# EAGLE design RHD2164_headstage1 (EAGLE 6.2)
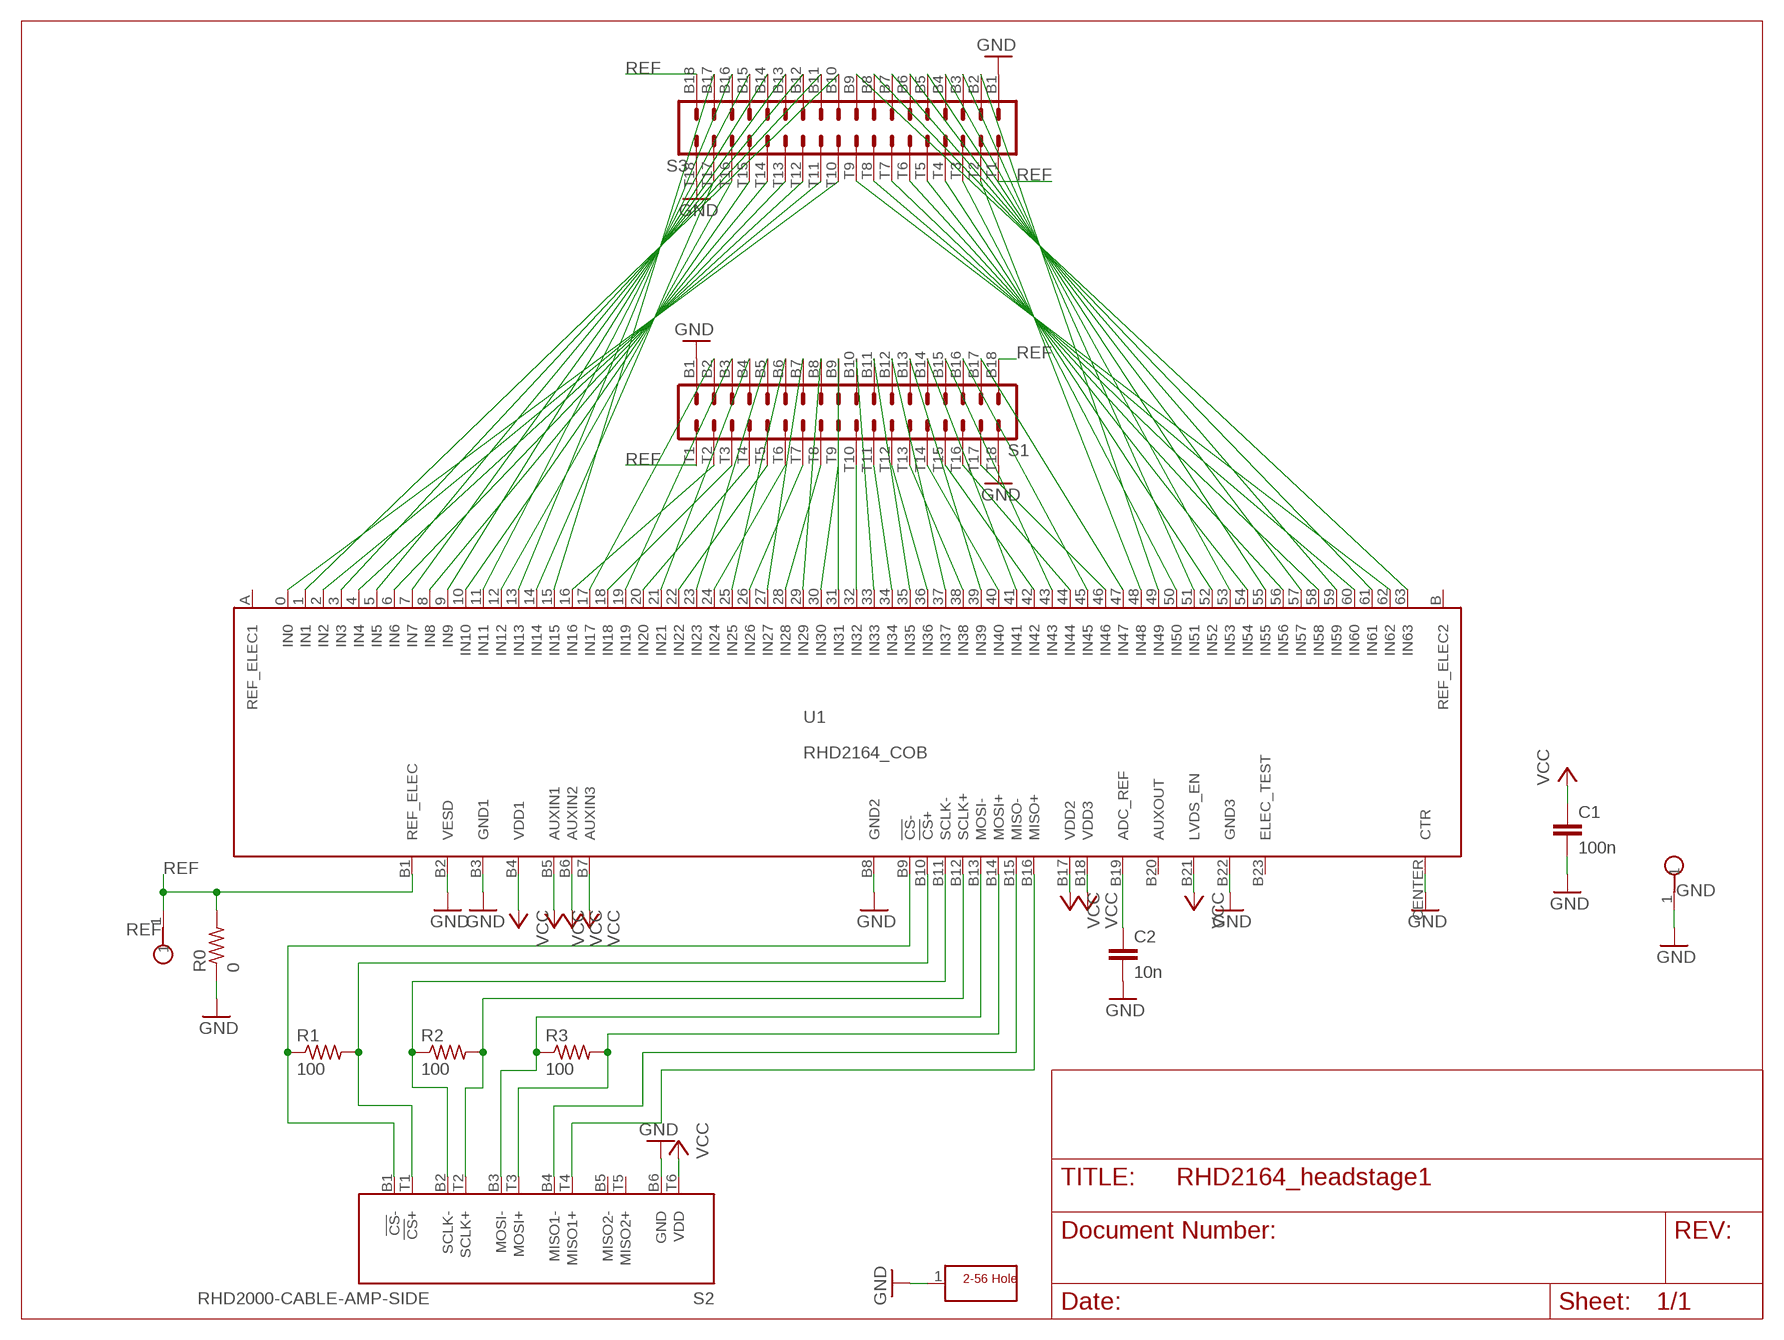
[diagram p0: schematic, sheet 1]

## Parts
C1  100n  C_0402  [0402]
C2  10n  C_0201  [0201]
GND  TESTPOINT_SMALL  [TESTPOINT_SMALL]
H1  SCREW_HOLE_2-56  [SCREW_HOLE_2-56]
R0  0  R_0402  [0402]
R1  100  R_0201  [0201]
R2  100  R_0201  [0201]
R3  100  R_0201  [0201]
REF  TESTPOINT_SMALL  [TESTPOINT_SMALL]
S1  OMNETICS_A79025  [OMNETICS_A79025]
S2  RHD2000-CABLE-AMP-SIDE  [OMNETICS_PZN-12-AA]
S3  OMNETICS_A79025  [OMNETICS_A79025]
U1  RHD2164_COB  [RHD2164_COB]

## Nets
GND [thick]: C1.2 C2.2 GND.1 H1.1 R0.1 S1.B1 S1.T18 S2.B6(GND) S3.B1 S3.T18 U1.B2(VESD) U1.B3(GND1) U1.B8(GND2) U1.B22(GND3) U1.CENTER(CTR)
N$1: S2.T4(MISO1+) U1.B16(MISO+)
N$2: S1.T2 U1.16(IN16)
N$3: S1.B2 U1.17(IN17)
N$4: S1.T3 U1.18(IN18)
N$5: S1.B3 U1.19(IN19)
N$6: S1.T4 U1.20(IN20)
N$7: S1.B4 U1.21(IN21)
N$8: S1.T5 U1.22(IN22)
N$9: S1.B5 U1.23(IN23)
N$10: S1.T6 U1.24(IN24)
N$11: R1.1 S2.B1(!CS!-) U1.B9(!CS!-)
N$12: S1.B6 U1.25(IN25)
N$13: S1.T7 U1.26(IN26)
N$14: S1.B7 U1.27(IN27)
N$15: S1.T8 U1.28(IN28)
N$16: S1.B8 U1.29(IN29)
N$17: S1.T9 U1.30(IN30)
N$18: S1.B9 U1.31(IN31)
N$19: S1.T10 U1.32(IN32)
N$20: S1.B10 U1.33(IN33)
N$21: S1.T11 U1.34(IN34)
N$22: S1.B11 U1.35(IN35)
N$23: S1.T12 U1.36(IN36)
N$24: S1.B12 U1.37(IN37)
N$25: S1.T13 U1.38(IN38)
N$26: S1.B13 U1.39(IN39)
N$27: S1.T14 U1.40(IN40)
N$28: S1.B14 U1.41(IN41)
N$29: S1.T15 U1.42(IN42)
N$30: S1.B15 U1.43(IN43)
N$31: S1.T16 U1.44(IN44)
N$32: S1.B16 U1.45(IN45)
N$33: S1.T17 U1.46(IN46)
N$34: S1.B17 U1.47(IN47)
N$35: R1.2 S2.T1(!CS!+) U1.B10(!CS!+)
N$36: R2.1 S2.B2(SCLK-) U1.B11(SCLK-)
N$37: R2.2 S2.T2(SCLK+) U1.B12(SCLK+)
N$38: R3.1 S2.B3(MOSI-) U1.B13(MOSI-)
N$39: R3.2 S2.T3(MOSI+) U1.B14(MOSI+)
N$40: S2.B4(MISO1-) U1.B15(MISO-)
N$41: S3.B17 U1.15(IN15)
N$42 [thick]: C2.1 U1.B19(ADC_REF)
N$43: S3.T17 U1.14(IN14)
N$44: S3.B16 U1.13(IN13)
N$45: S3.T16 U1.12(IN12)
N$46: S3.B15 U1.11(IN11)
N$47: S3.T15 U1.10(IN10)
N$48: S3.B14 U1.9(IN9)
N$49: S3.T14 U1.8(IN8)
N$50: S3.B13 U1.7(IN7)
N$51: S3.T13 U1.6(IN6)
N$52: S3.B12 U1.5(IN5)
N$53: S3.T12 U1.4(IN4)
N$54: S3.B11 U1.3(IN3)
N$55: S3.T11 U1.2(IN2)
N$56: S3.B10 U1.1(IN1)
N$57: S3.T10 U1.0(IN0)
N$58: S3.T2 U1.48(IN48)
N$59: S3.B2 U1.49(IN49)
N$60: S3.T3 U1.50(IN50)
N$61: S3.B3 U1.51(IN51)
N$62: S3.T4 U1.52(IN52)
N$63: S3.B4 U1.53(IN53)
N$64: S3.T5 U1.54(IN54)
N$65: S3.B5 U1.55(IN55)
N$66: S3.T6 U1.56(IN56)
N$67: S3.B6 U1.57(IN57)
N$68: S3.T7 U1.58(IN58)
N$69: S3.B7 U1.59(IN59)
N$70: S3.T8 U1.60(IN60)
N$71: S3.B8 U1.61(IN61)
N$72: S3.T9 U1.62(IN62)
N$73: S3.B9 U1.63(IN63)
REF [thick]: R0.2 REF.1 S1.B18 S1.T1 S3.B18 S3.T1 U1.B1(REF_ELEC)
VCC [thick]: C1.1 S2.T6(VDD) U1.B4(VDD1) U1.B5(AUXIN1) U1.B6(AUXIN2) U1.B7(AUXIN3) U1.B17(VDD2) U1.B18(VDD3) U1.B21(LVDS_EN)
Unconnected: S2.B5(MISO2-) S2.T5(MISO2+) U1.A(REF_ELEC1) U1.B20(AUXOUT) U1.B23(ELEC_TEST) U1.B(REF_ELEC2)

## Library data of the parts
C1 C2 = RHD2000_eval_board:C: Capacitor
GND REF = RHD2000_eval_board:TESTPOINT: PCB Test Point
H1 = RHD2000_eval_board:SCREW_HOLE_2-56: Mounting hole
R0 R1-R3 = RHD2000_eval_board:R: Resistor
S1 S3 = RHD2000:OMNETICS_A79025
S2 = RHD2000:RHD2000-CABLE-AMP-SIDE
U1 = RHD2000:RHD2164

## Net classes
1 thick: width 0.102 mm
2 power: width 0.61 mm

## Board
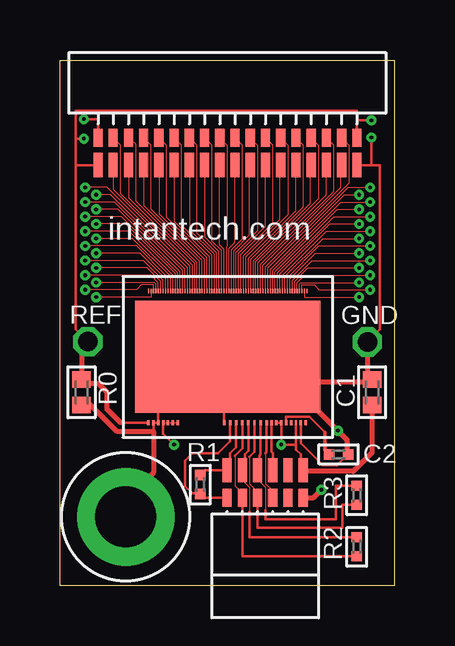
[diagram p1: board, top side]
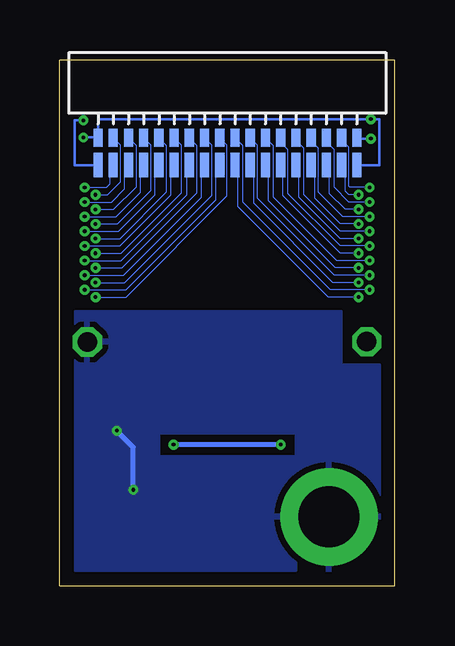
[diagram p2: board, bottom side, seen from below]

Size 13.97 x 21.91 mm. Coordinates in mm from the lower left corner, seen from the top.
Outline: 0,0 0,21.91 13.97,21.91 13.97,0 0,0
Copper layers (1*16): Top 0.035mm / dielectric 1.5mm / Bottom 0.035mm
Design rules: minimum track width 2mil, minimum drill 6mil, track to track 2mil, track to pad 2mil, pad to pad 2mil, via to via 2mil, smd to smd 2mil, copper to edge 20mil, drill to drill 15mil, minimum pad ring 5mil, minimum via ring 5mil, stop-mask expansion 2mil, vias tented up to drill 0mil, thermal gap 10mil
tRestrict: area 6.9,6.6 to 7,6.9; area 7.2,6.6 to 7.3,6.9; area 7.5,6.6 to 7.5,6.9; area 7.7,6.6 to 7.8,6.9; area 8,6.6 to 8,6.9; area 8.2,6.6 to 8.3,6.9

### Footprints (pad centres in the part's own frame; a part is rotated, then mirrored left to right if it is on the bottom)
0402 = smd 0.686 x 0.762: 1 -0.533,0; 2 0.533,0
0201 = smd 0.432 x 0.432: 1 -0.394,0; 2 0.394,0
TESTPOINT_SMALL = drill 0.813 octagon: 1 0,0
SCREW_HOLE_2-56 = drill 2.54 pad 4.064: 1 0,0
OMNETICS_A79025 = smd 0.381 x 0.762: B1 -5.397,-1.016; B2 -4.763,-1.016; B3 -4.128,-1.016; B4 -3.493,-1.016; B5 -2.857,-1.016; B6 -2.223,-1.016; B7 -1.587,-1.016; B8 -0.953,-1.016; B9 -0.318,-1.016; B10 0.318,-1.016; B11 0.953,-1.016; B12 1.587,-1.016; B13 2.223,-1.016; B14 2.857,-1.016; B15 3.493,-1.016; B16 4.128,-1.016; B17 4.763,-1.016; B18 5.397,-1.016 | smd 0.381 x 1.016: T1 -5.397,-2.159; T2 -4.763,-2.159; T3 -4.128,-2.159; T4 -3.493,-2.159; T5 -2.857,-2.159; T6 -2.223,-2.159; T7 -1.587,-2.159; T8 -0.953,-2.159; T9 -0.318,-2.159; T10 0.318,-2.159; T11 0.953,-2.159; T12 1.587,-2.159; T13 2.223,-2.159; T14 2.857,-2.159; T15 3.493,-2.159; T16 4.128,-2.159; T17 4.763,-2.159; T18 5.397,-2.159
OMNETICS_PZN-12-AA = smd 0.381 x 0.762: B1 1.587,-1.016; B2 0.953,-1.016; B3 0.318,-1.016; B4 -0.318,-1.016; B5 -0.953,-1.016; B6 -1.587,-1.016 | smd 0.381 x 1.016: T1 1.587,-2.159; T2 0.953,-2.159; T3 0.318,-2.159; T4 -0.318,-2.159; T5 -0.953,-2.159; T6 -1.587,-2.159
RHD2164_COB = smd 0.051 x 0.203: 0 -3.2,2.743; 1 -3.099,2.743; 2 -2.997,2.743; 3 -2.896,2.743; 4 -2.794,2.743; 5 -2.692,2.743; 6 -2.591,2.743; 7 -2.489,2.743; 8 -2.388,2.743; 9 -2.286,2.743; 10 -2.184,2.743; 11 -2.083,2.743; 12 -1.981,2.743; 13 -1.88,2.743; 14 -1.778,2.743; 15 -1.676,2.743; 16 -1.575,2.743; 17 -1.473,2.743; 18 -1.372,2.743; 19 -1.27,2.743; 20 -1.168,2.743; 21 -1.067,2.743; 22 -0.965,2.743; 23 -0.864,2.743; 24 -0.762,2.743; 25 -0.66,2.743; 26 -0.559,2.743; 27 -0.457,2.743; 28 -0.356,2.743; 29 -0.254,2.743; 30 -0.152,2.743; 31 -0.051,2.743; 32 0.051,2.743; 33 0.152,2.743; 34 0.254,2.743; 35 0.356,2.743; 36 0.457,2.743; 37 0.559,2.743; 38 0.66,2.743; 39 0.762,2.743; 40 0.864,2.743; 41 0.965,2.743; 42 1.067,2.743; 43 1.168,2.743; 44 1.27,2.743; 45 1.372,2.743; 46 1.473,2.743; 47 1.575,2.743; 48 1.676,2.743; 49 1.778,2.743; 50 1.88,2.743; 51 1.981,2.743; 52 2.083,2.743; 53 2.184,2.743; 54 2.286,2.743; 55 2.388,2.743; 56 2.489,2.743; 57 2.591,2.743; 58 2.692,2.743; 59 2.794,2.743; 60 2.896,2.743; 61 2.997,2.743; 62 3.099,2.743; 63 3.2,2.743; A -3.302,2.743; B 3.302,2.743 | smd 0.102 x 0.203: B1 -3.302,-2.743; B2 -3.099,-2.743; B3 -2.896,-2.743; B4 -2.692,-2.743; B5 -2.489,-2.743; B6 -2.286,-2.743; B7 -2.083,-2.743; B8 -0.152,-2.743; B9 0.102,-2.743; B10 0.356,-2.743; B11 0.61,-2.743; B12 0.864,-2.743; B13 1.118,-2.743; B14 1.372,-2.743; B15 1.626,-2.743; B16 1.829,-2.743; B17 2.032,-2.743; B18 2.235,-2.743; B19 2.438,-2.743; B20 2.642,-2.743; B21 2.845,-2.743; B22 3.048,-2.743; B23 3.251,-2.743 | smd 7.722 x 4.674: CENTER 0,0

### Placement (x,y rotation side)
C1  13.02,8.06 90 top
C2  11.62,5.47 0 top
GND  12.83,10.16 0 top
H1  2.74,2.87 0 top
R0  0.9,8.06 90 top
R1  5.85,4.22 90 top
R2  12.38,1.63 90 top
R3  12.38,3.77 90 top
REF  1.17,10.17 0 top
S1  6.99,19.68 0 top
S2  8.56,2.65 180 top
S3  6.99,19.68 0 bottom
U1  7,9.54 0 top

### Tracks (layer width: path | path; a pad name or v marks a point on that pad's centre or on a via)
GND  (via drill 0.15)
  Top 0.102: S1.T18 12.99,17.53 | v1,19.44 1.59,19.44 S1.B1 | 12.99,17.53 v12.99,18.68 | 12.99,17.53 13.35,17.53 13.35,10.68 GND.1 | 7,7.53 7,7.66 | 7,7.66 U1.CENTER | U1.B8 6.84,7.56 6.87,7.53 | 12.83,8.79 C1.2 13.02,8.47 | 3.9,6.44 U1.B2 U1.B3 4.1,7.28 4.13,7.3 6.64,7.3 6.87,7.53 | U1.B22 10.05,5.93 10.96,5.02 11.56,5.02 C2.2 11.98,5.51 | 9.59,8.47 9.34,8.47 8.52,7.66 7,7.66 | 6.87,7.53 7,7.66 | 2.74,3.56 2.73,3.54
  Top 0.203: GND.1 12.83,8.79 | 13.02,8.47 9.59,8.47 v11.6,6.46 11.98,6.08 11.98,5.51 | R0.1 1.28,7.53 2.38,6.44 3.9,6.44 3.9,4.71 2.74,3.56 H1.1 | S2.B6 10.58,3.67 v10.91,4
  Bottom 0.051: v12.99,18.68 12.39,18.68 S3.B1 | S3.T18 1.56,17.53 1.56,17.51
  Bottom 0.102: S3.T18 0.65,17.53 0.65,19.44 v1,19.44 12.38,19.44 12.38,18.68 v12.99,18.68
  Bottom 0.203: v10.91,4 10.91,5.78 v11.6,6.46
  pour Bottom: 0.64,0.64 0.64,9.21 2.22,9.21 2.22,11.43 13.34,11.43 13.34,0.64 9.84,0.64 9.84,6.35 4.13,6.35 4.13,0.64
  pour Bottom: 4.13,0.64 4.13,5.4 9.84,5.4 9.84,0.64
N$1
  Top 0.102: U1.B16 8.83,5.58 8.88,5.52 S2.T4
N$2
  Top 0.051: U1.16 5.42,13.31 2.23,16.5 2.23,17.51 S1.T2
N$3
  Top 0.051: U1.17 5.52,13.36 2.54,16.34 2.54,18.35 S1.B2
N$4
  Top 0.051: U1.18 5.63,13.41 2.9,16.14 2.9,17.49 S1.T3
N$5
  Top 0.051: U1.19 5.73,13.46 3.17,16.02 3.17,18.4 S1.B3
N$6
  Top 0.051: U1.20 5.83,13.51 3.5,15.84 3.5,17.51 S1.T4
N$7
  Top 0.051: U1.21 5.93,13.56 3.81,15.68 3.81,18.35 S1.B4
N$8
  Top 0.051: U1.22 6.03,13.61 4.17,15.48 4.17,17.49 S1.T5
N$9
  Top 0.051: U1.23 6.13,13.66 4.45,15.35 4.45,18.35 S1.B5
N$10
  Top 0.051: U1.24 6.24,13.72 4.78,15.18 4.78,17.51 S1.T6
N$11
  Top 0.102: S2.B1 6.01,3.67 R1.1 5.83,3.85 5.52,3.85 5.22,4.15 5.22,5.22 5.52,5.52 6.59,5.52 7.1,6.03 U1.B9
N$12
  Top 0.051: U1.25 6.34,13.77 5.08,15.02 5.08,18.35 S1.B6
N$13
  Top 0.051: U1.26 6.44,13.82 5.44,14.82 5.44,17.49 S1.T7
N$14
  Top 0.051: U1.27 6.54,13.87 5.71,14.69 5.71,18.35 S1.B7
N$15
  Top 0.051: U1.28 6.64,13.92 6.04,14.52 6.04,17.51 S1.T8
N$16
  Top 0.051: U1.29 6.74,13.97 6.35,14.36 6.35,18.35 S1.B8
N$17
  Top 0.051: U1.30 6.84,14.02 6.66,14.21 6.66,17.51 S1.T9
N$18
  Top 0.051: S1.B9 6.97,18.36 6.97,14.16 6.95,14.13 U1.31
N$19
  Top 0.051: U1.32 7.05,14.06 7.3,14.31 S1.T10
N$20
  Top 0.051: U1.33 7.15,14.01 7.61,14.46 7.61,18.36 S1.B10
N$21
  Top 0.051: U1.34 7.25,13.96 7.91,14.62 7.91,17.5 S1.T11
N$22
  Top 0.051: U1.35 7.35,13.91 8.27,14.82 8.27,18.34 S1.B11
N$23
  Top 0.051: U1.36 7.46,13.86 8.57,14.97 S1.T12
N$24
  Top 0.051: U1.37 7.56,13.8 8.88,15.13 8.88,18.36 S1.B12
N$25
  Top 0.051: U1.38 7.66,13.75 9.18,15.28 9.18,17.5 S1.T13
N$26
  Top 0.051: U1.39 7.76,13.7 9.54,15.48 9.54,18.34 S1.B13
N$27
  Top 0.051: U1.40 7.86,13.65 9.84,15.63 S1.T14
N$28
  Top 0.051: U1.41 7.96,13.6 10.15,15.79 10.15,18.36 S1.B14
N$29
  Top 0.051: U1.42 8.06,13.55 10.45,15.94 10.45,17.5 S1.T15
N$30
  Top 0.051: U1.43 8.17,13.5 10.81,16.14 10.81,18.34 S1.B15
N$31
  Top 0.051: U1.44 8.27,13.45 11.11,16.29 S1.T16
N$32
  Top 0.051: U1.45 8.37,13.4 11.42,16.45 11.42,18.36 S1.B16
N$33
  Top 0.051: U1.46 8.47,13.35 11.72,16.6 11.72,17.5 S1.T17
N$34
  Top 0.051: U1.47 8.57,13.3 12.08,16.8 12.08,18.34 S1.B17
N$35
  Top 0.102: R1.2 6.06,4.81 S2.T1 7.1,4.94 7.1,5.52 7.35,5.78 U1.B10
N$36
  Top 0.051: 7.3,5.42 7.3,4.18 7.61,3.87 S2.B2
  Top 0.102: U1.B11 7.61,5.73 7.3,5.42 | S2.B2 7.61,1.23 R2.1
N$37
  Top 0.051: S2.T2 7.61,4.41 7.91,4.1 7.91,3.09
  Top 0.102: U1.B12 7.86,5.63 7.71,5.47 7.71,4.92 S2.T2 | 7.91,3.09 7.91,2.02 R2.2
N$38
  Top 0.051: 7.91,5.37 7.91,4.25 8.24,3.92 S2.B3 8.24,3.82
  Top 0.102: U1.B13 8.12,5.58 7.91,5.37 | S2.B3 8.24,2.43 11.77,2.43 11.77,3.38 R3.1
N$39
  Top 0.051: S2.T3 8.24,4.43 8.57,4.1 8.57,3.14
  Top 0.102: U1.B14 8.37,5.47 8.32,5.42 8.32,4.89 S2.T3 | 8.57,3.14 8.57,2.78 11.52,2.78 11.52,4.17 R3.2
N$40
  Top 0.051: 8.57,5.52 8.57,4.25 8.88,3.95 S2.B4 8.88,3.85
  Top 0.102: U1.B15 8.62,5.58 8.57,5.52
N$41  (via drill 0.15)
  Top 0.051: U1.15 5.32,13.25 1.97,16.6 v1.05,16.6
  Bottom 0.051: v1.05,16.6 1.87,16.6 1.92,16.65 1.92,18.27 2.22,18.58 S3.B17
N$42
  Top 0.102: U1.B19 9.44,7.05 10.4,7.05 11.06,6.39 | 11.06,5.64 C2.1
  Top 0.152: 11.06,6.39 11.06,5.64
N$43  (via drill 0.15)
  Top 0.051: U1.14 5.22,13.2 2.12,16.29 v1.51,16.29
  Bottom 0.051: v1.51,16.29 1.92,16.29 2.07,16.45 2.07,17.06 2.22,17.21 S3.T17
N$44  (via drill 0.15)
  Top 0.051: U1.13 5.12,13.14 2.27,15.99 v1.05,15.99
  Bottom 0.051: v1.05,15.99 1.92,15.99 2.53,16.6 2.53,18.17 2.86,18.5 S3.B16
N$45  (via drill 0.15)
  Top 0.051: U1.12 5.02,13.09 2.43,15.68 v1.51,15.68
  Bottom 0.051: v1.51,15.68 2.07,15.68 2.73,16.34 2.73,17.06 2.86,17.18 S3.T16
N$46  (via drill 0.15)
  Top 0.051: U1.11 4.92,13.04 2.58,15.38 v1.05,15.38
  Bottom 0.051: v1.05,15.38 2.17,15.38 3.19,16.4 3.19,18.22 3.49,18.53 S3.B15
N$47  (via drill 0.15)
  Top 0.051: U1.10 4.81,12.99 2.73,15.07 v1.51,15.07
  Bottom 0.051: v1.51,15.07 2.27,15.07 3.34,16.14 3.34,17.37 S3.T15
N$48  (via drill 0.15)
  Top 0.051: U1.9 4.71,12.94 2.88,14.77 v1.05,14.77
  Bottom 0.051: v1.05,14.77 2.27,14.77 3.8,16.29 3.8,18.22 4.13,18.55 S3.B14
N$49  (via drill 0.15)
  Top 0.051: U1.8 4.61,12.89 3.04,14.46 v1.51,14.46
  Bottom 0.051: v1.51,14.46 2.27,14.46 4,16.19 4,17.4 S3.T14
N$50  (via drill 0.15)
  Top 0.051: v1.05,14.16 3.19,14.16 4.51,12.84 U1.7
  Bottom 0.051: v1.05,14.16 2.27,14.16 4.46,16.34 4.46,18.17 4.76,18.48 S3.B13
N$51  (via drill 0.15)
  Top 0.051: U1.6 4.41,12.79 3.34,13.86 v1.51,13.86
  Bottom 0.051: v1.51,13.86 2.27,13.86 4.66,16.24 4.66,17.42 S3.T13
N$52  (via drill 0.15)
  Top 0.051: v1.05,13.55 3.49,13.55 4.3,12.74 U1.5
  Bottom 0.051: v1.05,13.55 2.43,13.55 5.07,16.19 5.07,18.34 S3.B12
N$53  (via drill 0.15)
  Top 0.051: U1.4 4.2,12.69 3.65,13.25 v1.51,13.25
  Bottom 0.051: v1.51,13.25 2.48,13.25 5.27,16.04 5.27,17.4 S3.T12
N$54  (via drill 0.15)
  Top 0.051: U1.3 4.1,12.64 3.8,12.94 v1.05,12.94
  Bottom 0.051: v1.05,12.94 2.53,12.94 5.73,16.14 5.73,18.36 S3.B11
N$55  (via drill 0.15)
  Top 0.051: U1.2 4,12.59 3.95,12.64 v1.51,12.64
  Bottom 0.051: v1.51,12.64 2.58,12.64 5.88,15.94 5.88,17.37 S3.T11
N$56  (via drill 0.15)
  Top 0.051: U1.1 3.9,12.54 3.39,12.54 3.19,12.33 v1.05,12.33
  Bottom 0.051: v1.05,12.33 2.68,12.33 6.34,15.99 6.34,18.34 S3.B10
N$57  (via drill 0.15)
  Top 0.051: U1.0 3.8,12.03 v1.51,12.03
  Bottom 0.051: v1.51,12.03 2.78,12.03 6.54,15.79 6.54,17.4 S3.T10
N$58  (via drill 0.15)
  Top 0.051: U1.48 8.67,13.25 12.03,16.6 v12.94,16.6
  Bottom 0.051: v12.94,16.6 12.03,16.6 11.87,16.75 11.87,17.4 S3.T2
N$59  (via drill 0.15)
  Top 0.051: U1.49 8.78,13.2 11.87,16.29 v12.48,16.29
  Bottom 0.051: v12.48,16.29 11.98,16.29 11.44,16.83 11.44,18.36 S3.B2
N$60  (via drill 0.15)
  Top 0.051: U1.50 8.88,13.14 11.72,15.99 v12.94,15.99
  Bottom 0.051: v12.94,15.99 11.82,15.99 11.27,16.55 11.27,17.37 S3.T3
N$61  (via drill 0.15)
  Top 0.051: U1.51 8.98,13.09 11.57,15.68 v12.48,15.68
  Bottom 0.051: v12.48,15.68 11.72,15.68 10.78,16.62 10.78,18.34 S3.B3
N$62  (via drill 0.15)
  Top 0.051: U1.52 9.08,13.04 11.42,15.38 v12.94,15.38
  Bottom 0.051: v12.94,15.38 11.62,15.38 10.6,16.4 10.6,17.4 S3.T4
N$63  (via drill 0.15)
  Top 0.051: U1.53 9.18,12.99 11.27,15.07 v12.48,15.07
  Bottom 0.051: v12.48,15.07 11.57,15.07 10.17,16.47 10.17,18.36 S3.B4
N$64  (via drill 0.15)
  Top 0.051: U1.54 9.28,12.94 11.11,14.77 v12.94,14.77
  Bottom 0.051: v12.94,14.77 11.52,14.77 9.99,16.29 9.99,17.37 S3.T5
N$65  (via drill 0.15)
  Top 0.051: U1.55 9.38,12.89 10.96,14.46 v12.48,14.46
  Bottom 0.051: v12.48,14.46 11.47,14.46 9.51,16.42 9.51,18.34 S3.B5
N$66  (via drill 0.15)
  Top 0.051: U1.56 9.49,12.84 10.81,14.16 v12.94,14.16
  Bottom 0.051: v12.94,14.16 11.47,14.16 9.34,16.29 9.34,17.4 S3.T6
N$67  (via drill 0.15)
  Top 0.051: U1.57 9.59,12.79 10.65,13.86 v12.48,13.86
  Bottom 0.051: v12.48,13.86 11.42,13.86 8.9,16.37 8.9,18.36 S3.B6
N$68  (via drill 0.15)
  Top 0.051: U1.58 9.69,12.74 10.5,13.55 v12.94,13.55
  Bottom 0.051: v12.94,13.55 11.42,13.55 8.67,16.29 8.67,17.42 S3.T7
N$69  (via drill 0.15)
  Top 0.051: U1.59 9.79,12.69 10.35,13.25 v12.48,13.25
  Bottom 0.051: v12.48,13.25 11.37,13.25 8.24,16.37 8.24,18.34 S3.B7
N$70  (via drill 0.15)
  Top 0.051: U1.60 9.89,12.64 10.2,12.94 v12.94,12.94
  Bottom 0.051: v12.94,12.94 11.32,12.94 8.06,16.19 8.06,17.4 S3.T8
N$71  (via drill 0.15)
  Top 0.051: U1.61 9.99,12.59 10.05,12.64 v12.48,12.64
  Bottom 0.051: v12.48,12.64 11.27,12.64 7.63,16.27 7.63,18.36 S3.B8
N$72  (via drill 0.15)
  Top 0.051: U1.62 10.1,12.54 10.6,12.54 10.81,12.33 v12.94,12.33
  Bottom 0.051: v12.94,12.33 11.21,12.33 7.46,16.09 7.46,17.37 S3.T9
N$73  (via drill 0.15)
  Top 0.051: U1.63 10.2,12.03 v12.48,12.03
  Bottom 0.051: v12.48,12.03 11.21,12.03 7,16.24 7,18.36 S3.B9
REF  (via drill 0.15)
  Top 0.102: S1.T1 0.65,17.53 | 0.65,17.53 0.65,10.69 REF.1 | S1.B18 12.38,19.39 | 12.38,19.39 12.38,19.8 0.65,19.8 0.65,18.63 | 0.65,18.63 0.65,17.53 | v1,18.63 0.65,18.63 | v12.99,19.39 12.38,19.39 | U1.B1 2.53,6.79 | 1.08,8.42 R0.2
  Top 0.203: REF.1 0.9,9.91 R0.2 | 2.53,6.79 1.97,7.35 1.97,8.06 1.61,8.42 1.08,8.42
  Bottom 0.051: S3.B18 1.55,18.63
  Bottom 0.102: 1.55,18.63 v1,18.63 | S3.T1 13.35,17.53 13.35,19.39 v12.99,19.39
VCC  (via drill 0.15)
  Top 0.051: U1.B4 U1.B5 U1.B6 U1.B7
  Top 0.102: U1.B17 U1.B18 v9.23,5.88 9.84,5.88 | U1.B21 9.84,5.88 | 9.84,5.88 9.84,5.68 10.05,5.47 10.05,4.92 S2.T6 10.2,4.76 | U1.B4 4.3,6.34 v4.76,5.88
  Top 0.203: C1.1 13.02,5.55 12.23,4.76 10.2,4.76
  Bottom 0.203: v4.76,5.88 v9.23,5.88

### Text on the board
tPlace: intantech.com